# EAGLE design daughterboard_ver4.1 (EAGLE 9.7.0)
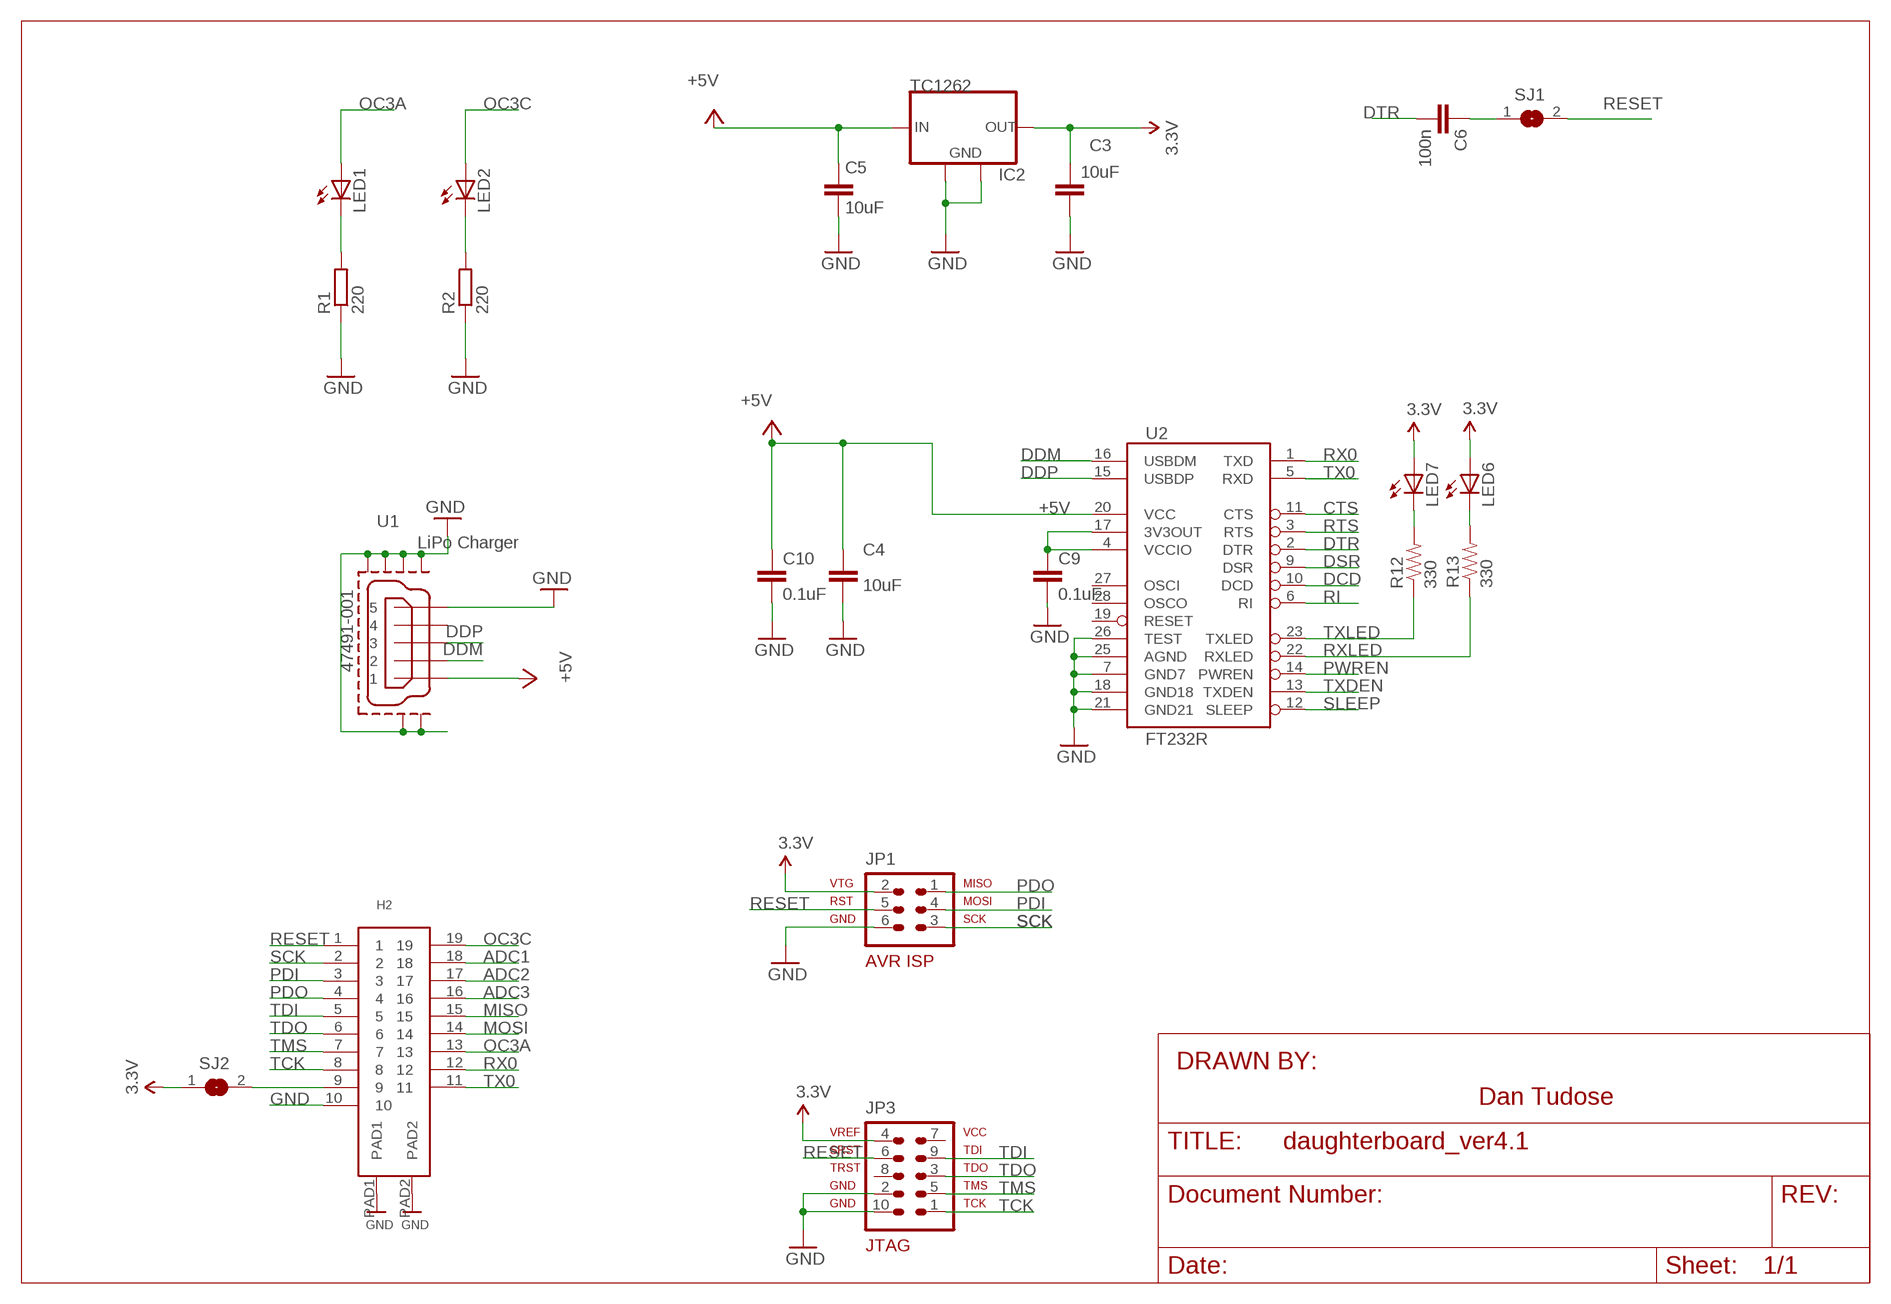
[diagram p0: schematic, sheet 1]

## Parts
C3  10uF  C-EUC0402  [C0402]
C4  10uF  C-EUC0402  [C0402]
C5  10uF  C-EUC0402  [C0402]
C6  100n  C-EUC0402  [C0402]
C9  0.1uF  CAP0402-CAP  [0402-CAP]
C10  0.1uF  CAP0402-CAP  [0402-CAP]
H2  DF9-19P-1V(32)  [DF9-19P-1V(32)]
IC2  TC1262  MCP1825S-SOT223  [SOT223]
JP1  AVR-ISP-6SMD  [2X3SMD]
JP3  AVR-JTAG-10  [AVR-JTAG-10]
LED1  LEDCHIPLED_0603  [CHIPLED_0603]
LED2  LEDCHIPLED_0603  [CHIPLED_0603]
LED6  LEDCHIP-LED0603  [CHIP-LED0603]
LED7  LEDCHIP-LED0603  [CHIP-LED0603]
R1  220  R-EU_R0402  [R0402]
R2  220  R-EU_R0402  [R0402]
R12  330  RESISTOR0402-RES  [0402-RES]
R13  330  RESISTOR0402-RES  [0402-RES]
SJ1  SJ  [SJ]
SJ2  SJ  [SJ]
U1  47491-001  [47491-0001]
U2  FT232R  FT232RLSSOP  [SSOP28DB]

## Nets
3.3V: C3.1 IC2.3(OUT) JP1.2 JP3.4 LED6.A LED7.A SJ2.1
+5V [power]: C4.1 C5.1 C10.1 IC2.1(IN) U1.1 U2.20(VCC)
ADC1: H2.18
ADC2: H2.17
ADC3: H2.16
CTS: U2.11(CTS)
DCD: U2.10(DCD)
DDM: U1.2 U2.16(USBDM)
DDP: U1.3 U2.15(USBDP)
DSR: U2.9(DSR)
DTR: C6.2 U2.2(DTR)
GND: C3.2 C4.2 C5.2 C9.2 C10.2 H2.10 H2.PAD1 H2.PAD2 IC2.2(GND) IC2.4(GND) JP1.6 JP3.2 JP3.10 R1.1 R2.1 U1.5 U1.GND1 U1.GND2 U1.GND3 U1.GND4 U1.GND5 U1.GND6 U2.7(GND7) U2.18(GND18) U2.21(GND21) U2.25(AGND) U2.26(TEST)
MISO: H2.15
MOSI: H2.14
N$1: LED7.C R12.2
N$2: LED6.C R13.2
N$3: H2.9 SJ2.2
N$9: LED1.C R1.2
N$11: LED2.C R2.2
N$13: C9.1 U2.4(VCCIO) U2.17(3V3OUT)
N$34: C6.1 SJ1.1
OC3A: H2.13 LED1.A
OC3C: H2.19 LED2.A
PDI: H2.3 JP1.4
PDO: H2.4 JP1.1
PWREN: U2.14(PWREN)
RESET: H2.1 JP1.5 JP3.6 SJ1.2
RI: U2.6(RI)
RTS: U2.3(RTS)
RX0: H2.12 U2.1(TXD)
RXLED: R13.1 U2.22(RXLED)
SCK: H2.2 JP1.3
SLEEP: U2.12(SLEEP)
TCK: H2.8 JP3.1
TDI: H2.5 JP3.9
TDO: H2.6 JP3.3
TMS: H2.7 JP3.5
TX0: H2.11 U2.5(RXD)
TXDEN: U2.13(TXDEN)
TXLED: R12.1 U2.23(TXLED)
Unconnected: JP3.7 JP3.8 U1.4 U2.19(RESET) U2.27(OSCI) U2.28(OSCO)

## Notes on the sheet
- LiPo Charger
- DRAWN BY:
- Dan Tudose

## Library data of the parts
C3-C6 = rcl:C-EU: CAPACITOR, European symbol
C9 C10 = SparkFun:CAP: Capacitor Standard 0603 ceramic capacitor, and 0.1" leaded capacitor.
H2 = dan:DF9-19P-1V(32)
IC2 = Spark:MCP1825S: 500 mA, Low Voltage, Low Quiescent Current LDO Regulator
JP1 = atmel-1:AVR-ISP-6: AVR ISP-6 Serial Programming Header
JP3 = dan:AVR-JTAG-10: AVR JTAG Debug/Programming Header
LED1 LED2 LED6 LED7 = led:LED: LED OSRAM: - CHIPLED LG R971, LG N971, LY N971, LG Q971, LY Q971, LO R971, LY R971 LH N974, LH R974 LS Q976, LO Q976, LY Q976 LO Q996 - Hyper CHIPLED LW Q18S LB Q993, LB Q99A, LB R99A - SideLED LS A670, LO A670, LY A670, LG A670, LP A670 LB A673, LV A673, LT A673, LW A673 LH A674 LY A675 LS A676, LA A676, LO A676, LY A676, LW A676 LS A679, LY A679, LG A679 - Hyper Micro SIDELED® LS Y876, LA Y876, LO Y876, LY Y876 LT Y87S - SmartLED LW L88C, LW L88S LB L89C, LB L89S, LG L890 LS L89K, LO L89K, LY L89K LS L896, LA L896, LO L896, LY L896 - TOPLED LS T670, LO T670, LY T670, LG T670, LP T670 LSG T670, LSP T670, LSY T670, LOP T670, LYG T670 LG T671, LOG T671, LSG T671 LB T673, LV T673, LT T673, LW T673 LH T674 LS T676, LA T676, LO T676, LY T676, LB T676, LH T676, LSB T676, LW T676 LB T67C, LV T67C, LT T67C, LS T67K, LO T67K, LY T67K, LW E67C LS E67B, LA E67B, LO E67B, LY E67B, LB E67C, LV E67C, LT E67C LW T67C LS T679, LY T679, LG T679 LS T770, LO T770, LY T770, LG T770, LP T770 LB T773, LV T773, LT T773, LW T773 LH T774 LS E675, LA E675, LY E675, LS T675 LS T776, LA T776, LO T776, LY T776, LB T776 LHGB T686 LT T68C, LB T68C - Hyper Mini TOPLED® LB M676 - Mini TOPLED Santana® LG M470 LS M47K, LO M47K, LY M47K Source: http://www.osram.convergy.de LUXEON: - LUMILED® LXK2-PW12-R00, LXK2-PW12-S00, LXK2-PW14-U00, LXK2-PW14-V00 LXK2-PM12-R00, LXK2-PM12-S00, LXK2-PM14-U00 LXK2-PE12-Q00, LXK2-PE12-R00, LXK2-PE12-S00, LXK2-PE14-T00, LXK2-PE14-U00 LXK2-PB12-K00, LXK2-PB12-L00, LXK2-PB12-M00, LXK2-PB14-N00, LXK2-PB14-P00, LXK2-PB14-Q00 LXK2-PR12-L00, LXK2-PR12-M00, LXK2-PR14-Q00, LXK2-PR14-R00 LXK2-PD12-Q00, LXK2-PD12-R00, LXK2-PD12-S00 LXK2-PH12-R00, LXK2-PH12-S00 LXK2-PL12-P00, LXK2-PL12-Q00, LXK2-PL12-R00 Source: www.luxeon.com KINGBRIGHT: KA-3528ASYC Source: www.kingbright.com
R1 R2 = resistor:R-EU_: RESISTOR, European symbol
R12 R13 = SparkFun:RESISTOR: Resistor Basic schematic elements and footprints for 0603, 1206, and PTH 1/10th watt (small) resistors.
SJ1 SJ2 = jumper:SJ: SMD solder JUMPER
U1 = usb_con-update:47491-001
U2 = SparkFun:FT232RL: USB UART FT232RL 4th Generation USB UART (USB <-> Serial) Controller. Spark Fun Electronics SKU : COM-00650

## Net classes
1 power: width 0.61 mm

## Board
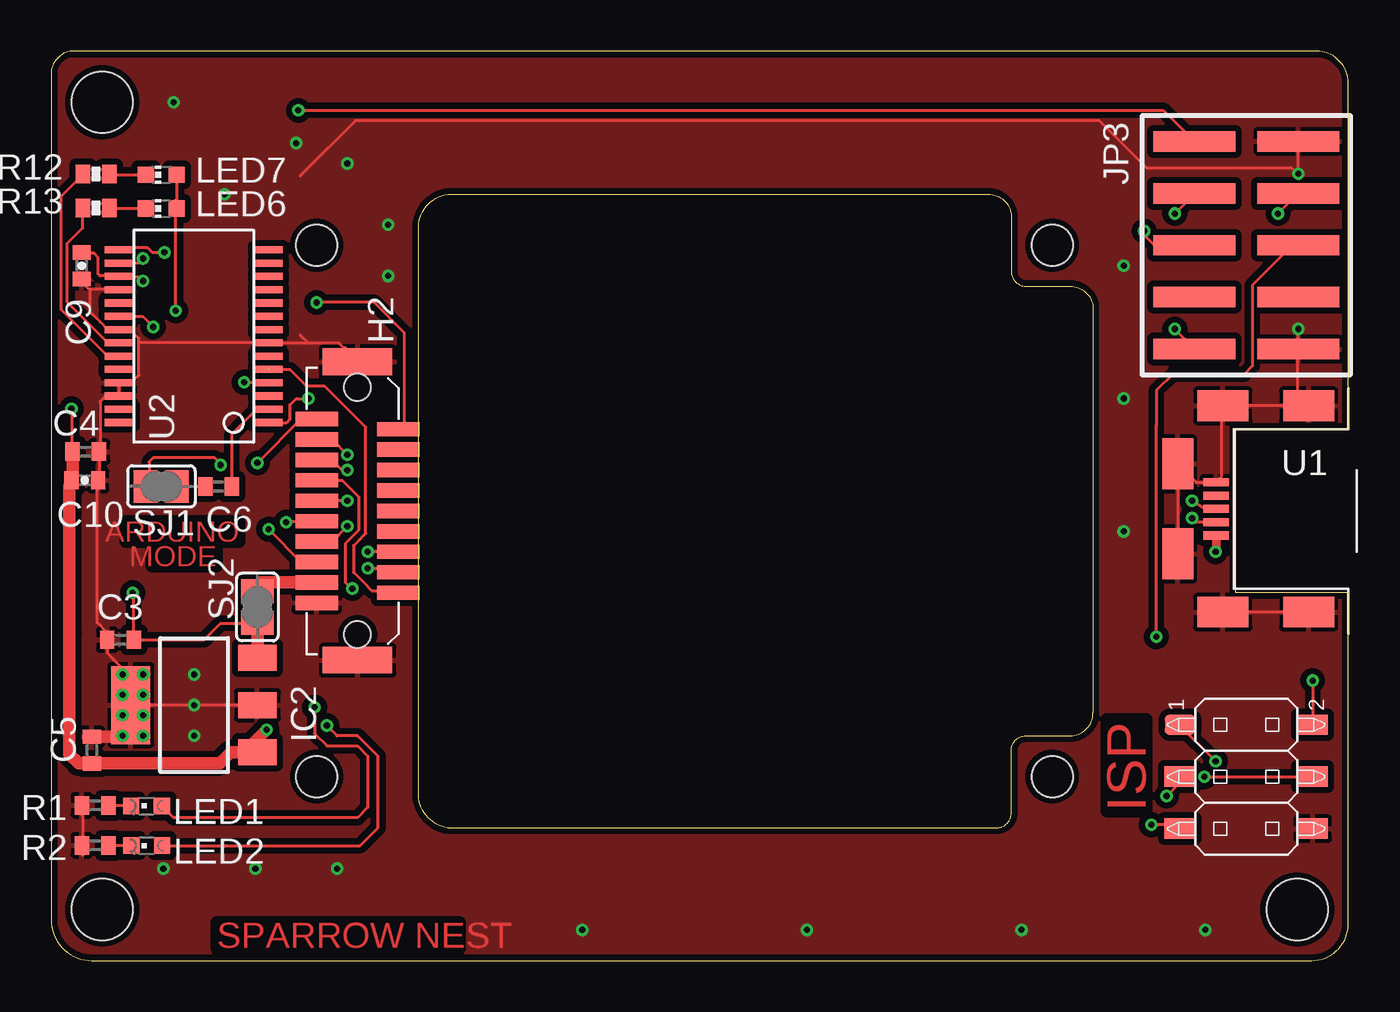
[diagram p1: board, top side]
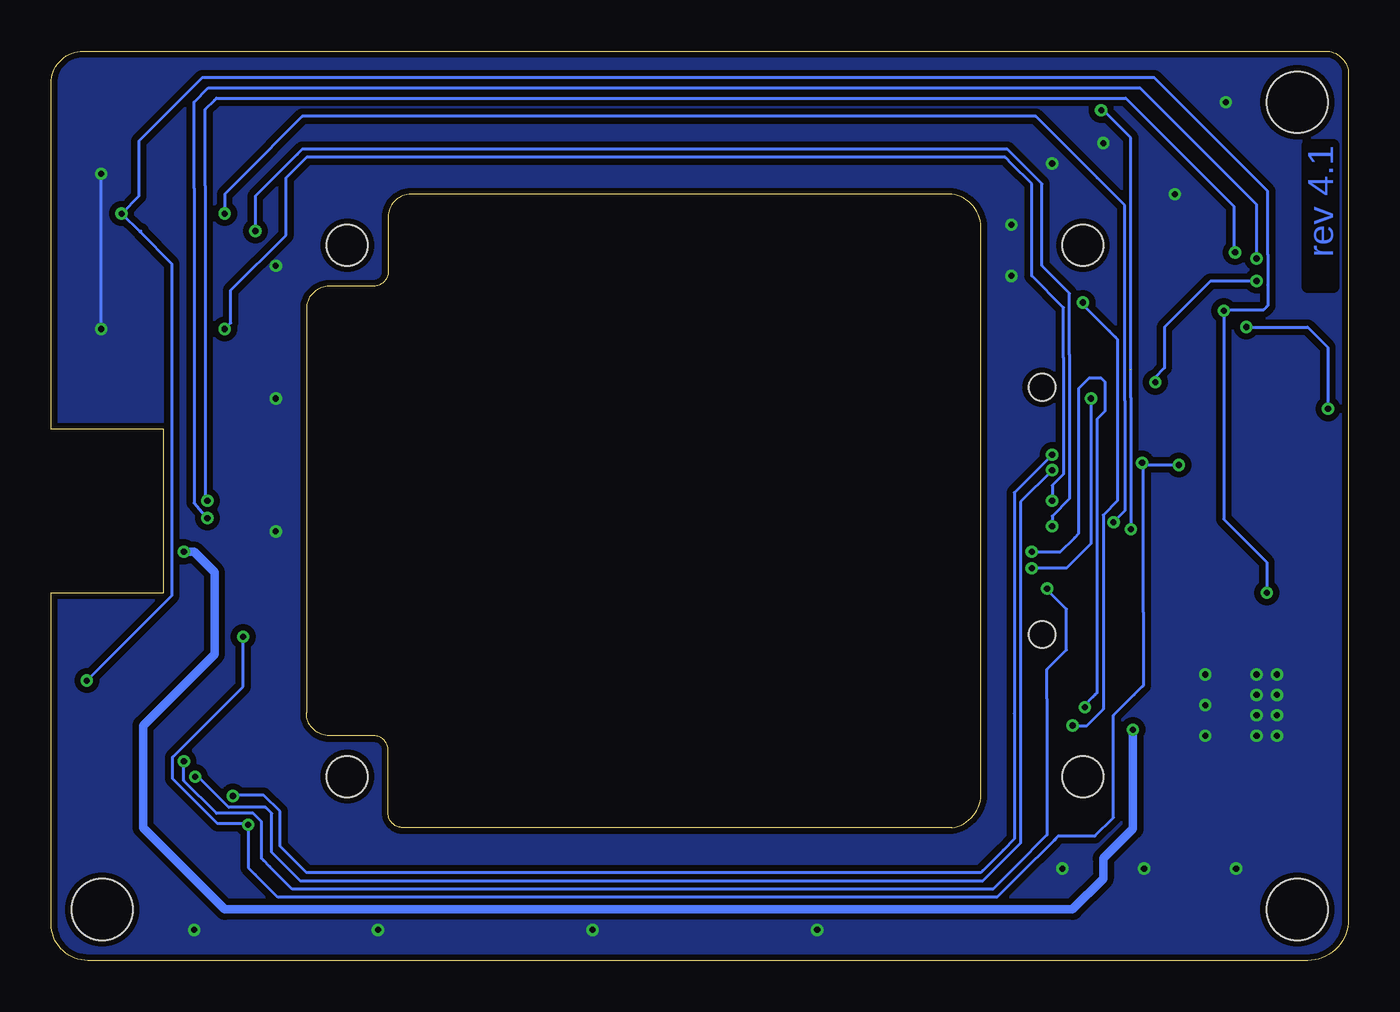
[diagram p2: board, bottom side, seen from below]

Size 63.5 x 44.5 mm. Coordinates in mm from the lower left corner, seen from the top.
Outline: 63.5,26 63.5,42.92 arc90 61.92,44.5 1.12,44.5 arc90 0,43.38 0,2 arc90 2,0 61.7,0 arc90 63.5,1.8 63.5,18 58,18 58,26 63.5,26
Outline: 19.41,6.5 46.29,6.5 arc90 47,7.21 47,10.29 arc-90 47.71,11 49.88,11 arc90 51,12.12 51,31.88 arc90 49.88,33 47.71,33 arc-90 47,33.71 47,36.38 arc90 45.88,37.5 19.41,37.5 arc90 18,35.59 18,8.41 arc90 19.41,6.5
Copper layers (1*16): Top 0.035mm / dielectric 1.5mm / Bottom 0.035mm
Design rules "Fusion Electronics Design Rules": minimum track width 0.15mm, minimum drill 0.3mm, track to track 0.15mm, track to pad 0.15mm, pad to pad 0.15mm, via to via 0.15mm, smd to smd 0.15mm, copper to edge 0.3mm, drill to drill 0.2mm, minimum pad ring 0.2mm, minimum via ring 0.15mm, stop-mask expansion 0.075mm, vias tented up to drill 12mil, thermal gap 0.2mm
Holes 3 mm at 2.5,42 2.5,2.5 61,2.5
Holes 2 mm at 49,9 49,35 13,9 13,35

### Footprints (pad centres in the part's own frame; a part is rotated, then mirrored left to right if it is on the bottom)
C0402 = smd 0.7 x 0.9: 1 -0.65,0; 2 0.65,0
0402-CAP = smd 0.7 x 0.9: 1 -0.65,0; 2 0.65,0
DF9-19P-1V(32) = smd 0.7 x 2.08: 1 -4.5,-2; 2 -3.5,-2; 3 -2.5,-2; 4 -1.5,-2; 5 -0.5,-2; 6 0.5,-2; 7 1.5,-2; 8 2.5,-2; 9 3.5,-2; 10 4.5,-2; 11 4,2; 12 3,2; 13 2,2; 14 1,2; 15 0,2; 16 -1,2; 17 -2,2; 18 -3,2; 19 -4,2 | smd 1.3 x 3.4: PAD1 7.3,0; PAD2 -7.3,0 | hole 1.3: 6.05,0; -6.05,0
SOT223 = smd 1.27 x 1.905: 1 -2.311,-3.099; 2 0,-3.099; 3 2.311,-3.099 | smd 3.81 x 1.905: 4 0,3.099
2X3SMD = smd 1 x 1.5: 1 -2.54,-3.25; 2 -2.54,3.25; 3 0,-3.25; 4 0,3.25; 5 2.54,-3.25; 6 2.54,3.25
AVR-JTAG-10 = smd 1 x 4: 1 -5.08,-2.54; 2 -5.08,2.54; 3 -2.54,-2.54; 4 -2.54,2.54; 5 0,-2.54; 6 0,2.54; 7 2.54,-2.54; 8 2.54,2.54; 9 5.08,-2.54; 10 5.08,2.54
CHIPLED_0603 = smd 0.8 x 0.8: A 0,-0.75; C 0,0.75
CHIP-LED0603 = smd 0.8 x 0.8: A 0,-0.75; C 0,0.75
R0402 = smd 0.7 x 0.9: 1 -0.65,0; 2 0.65,0
0402-RES = smd 0.7 x 0.9: 1 -0.65,0; 2 0.65,0
SJ = smd 1.168 x 1.6: 1 -0.762,0; 2 0.762,0
47491-0001 = smd 1.25 x 0.4: 1 6.475,5.2; 2 6.475,4.55; 3 6.475,3.9; 4 6.475,3.25; 5 6.475,2.6 | smd 2.5 x 1.5: GND1 1.95,8.95; GND2 6.15,8.95; GND5 6.15,-1.15; GND6 1.95,-1.15 | smd 1.5 x 2.5: GND3 8.35,6.1; GND4 8.35,1.7
SSOP28DB = smd 0.348 x 1.397: 1 -4.225,-3.656; 2 -3.575,-3.656; 3 -2.925,-3.656; 4 -2.275,-3.656; 5 -1.625,-3.656; 6 -0.975,-3.656; 7 -0.325,-3.656; 8 0.325,-3.656; 9 0.975,-3.656; 10 1.625,-3.656; 11 2.275,-3.656; 12 2.925,-3.656; 13 3.575,-3.656; 14 4.225,-3.656; 15 4.225,3.656; 16 3.575,3.656; 17 2.925,3.656; 18 2.275,3.656; 19 1.625,3.656; 20 0.975,3.656; 21 0.325,3.656; 22 -0.325,3.656; 23 -0.975,3.656; 24 -1.625,3.656; 25 -2.275,3.656; 26 -2.925,3.656; 27 -3.575,3.656; 28 -4.225,3.656

### Placement (x,y rotation side)
C3  3.4,15.7 180 top
C4  1.7,24.9 0 top
C5  2,10.3 90 top
C6  8.2,23.2 0 top
C9  1.5,34 270 top
C10  1.66,23.5 0 top
H2  15,22 270 top
IC2  7,12.5 90 top
JP1  58.5,9 270 top
JP3  58.5,35 270 top
LED1  4.67,7.57 90 top
LED2  4.69,5.63 90 top
LED6  5.4,36.8 90 top
LED7  5.4,38.45 90 top
R1  2.15,7.59 0 top
R2  2.15,5.64 0 top
R12  2.2,38.49 0 top
R13  2.2,36.83 0 top
SJ1  5.4,23.2 180 top
SJ2  10.1,17.3 90 top
U1  63.5,26 180 top
U2  6.99,30.55 90 top

### Tracks (layer width: path | path; a pad name or v marks a point on that pad's centre or on a via)
3.3V  (via drill 0.3)
  Top 0.15: LED7.A LED6.A 6.1,37.25 v6.1,31.8 | v61.75,13.7 JP1.2 | v60.05,36.55 61,37.5 JP3.4 | C3.1 4,15.7 | C3.1 7.5,15.7 8.3,16.5 10.1,16.5 | 10.1,16.5 10.2,16.6 | SJ2.1 10.1,16.5 | C3.1 4.05,17.95 v4,18
  Top 0.61: SJ2.1 10.1,16.5 IC2.3
  Bottom 0.15: v61.75,13.7 57.6,17.85 57.6,34.1 59.15,35.65 | 59.15,35.65 v60.05,36.55 59.2,37.4 59.2,40.1 56.1,43.2 9.5,43.2 3.95,37.65 3.95,34.55 3.95,33.05 3.95,32.05 4,32 4.15,31.85 6.05,31.85 v6.1,31.8 6.1,21.6 4,19.5 4,18.1 | 59.1,35.7 59.15,35.65 | 4,18.1 3.9,18 | v4,18 4,18.1
+5V  (via drill 0.3)
  Top 0.15: U2.20 4.47,31.52 v5,31 | v1,27 1,24.95 C4.1
  Top 0.406: U1.1 57.02,20.02 v57,20
  Top 0.61: C4.1 1.05,23.5 C10.1 0.9,23.2 0.9,15.95 0.9,10.1 1.35,9.65 C5.1 8.25,9.65 8.8,10.2 9.5,10.2 9.7,10.4 9.89,10.4 IC2.1 9.65,10.4 v10.55,11.3
  Bottom 0.15: v5,31 2,31 1,30 v1,27
  Bottom 0.406: v57,20 56.5,20 55.5,19 55.5,15 59,11.5 59,6.5 55,2.5 13.5,2.5 12,4 12,5 10.55,6.45 v10.55,11.3
DDM  (via drill 0.3)
  Top 0.15: U1.2 57,21.45 56.35,21.45 56.05,21.45 55.9,21.6 | U2.16 3.35,34.15 4.3,34.15 v4.5,34.35 | 55.9,21.6 v55.85,21.65 | v55.85,21.65 55.8,21.7 | v55.85,21.65 55.9,21.6
  Bottom 0.15: v55.85,21.65 56.5,22.4 56.5,37.8 56.5,42 55.8,42.7 10.2,42.7 4.5,37 4.5,34.4 v4.5,34.35
DDP  (via drill 0.3)
  Top 0.15: v55.85,22.5 56.45,22.1 57,22.1 U1.3 | v5.55,34.65 4.95,34.65 4.7,34.9 3.45,34.9 3.35,34.8 U2.15
  Bottom 0.15: v55.85,22.5 55.9,22.5 55.95,22.55 55.95,37.9 55.95,41.65 55.5,42.1 55.4,42.2 10.9,42.2 5.6,36.9 5.6,34.6 v5.55,34.65 | v55.85,22.5 55.8,22.5 v55.85,22.5
DTR
  Top 0.15: C6.2 8.85,25.75 10.05,26.95 10.6,26.95 U2.2
GND  (via drill 0.3)
  Top 0.15: 12.6,30.2 14.1,30.2 14.35,29.95 | 12.6,30.2 10.65,30.2 U2.7 10.6,30.25 4.35,30.25 4.3,30.25 | H2.PAD2 14.35,29.95 | 2.75,32.85 3.3,32.85 U2.18 | 4.3,30.25 4.3,28.65 3.92,28.27 U2.25 3.3,28.25 3.3,27.66 | 4.3,30.25 4.3,30.45 3.9,30.85 3.4,30.85 U2.21 3.3,30.9 2.75,30.9 2.4,31.25 1.9,31.75 1.9,32.8 1.95,32.85 2.75,32.85 | 3.35,27.7 U2.26 3.3,27.66 | R2.1 1.55,5.15 1.55,7.05 R1.1 | IC2.2 | IC2.2 | IC2.2 | IC2.2 10.05,12.5 3.95,12.5 IC2.4 3.8,12.5 3.7,12.6 3.7,13 3.7,14.1 3.1,14.7 2.75,15.05 C3.2 2.75,16.05 2.25,16.55 2.25,23.45 C10.2 2.35,23.5 C4.2 2.4,24.95 2.4,27.35 2.71,27.66 3.3,27.66 | v61.05,38.5 61.05,40.05 JP3.2 | v61.05,30.9 61.05,29.95 JP3.10 61,29.9 61,27.2 U1.GND6 U1.GND5 57.3,27.1 57.3,23.7 57.05,23.45 U1.5 57,23.4 56.05,23.4 U1.GND4 55.15,24.2 U1.GND3 55.2,19.85 | U1.GND1 61.5,17.05 U1.GND2 57.95,17.1 | 14.4,30 14.35,29.95 | 61,38.45 v61.05,38.5 | 2.75,32.85 1.85,32.85 1.5,33.2 1.5,33.3 | 1.5,33.3 C9.2 | C9.2 1.5,33.4 | C9.2 1.5,33.3 | v61.05,38.5 61,38.5 60.7,38.8 53.6,38.8 53.3,39.1 51.3,41.1 14.9,41.1 12.3,38.5 12.2,38.4 | 14.9,29.4 H2.PAD2 | H2.PAD2 15,29.2 H2.PAD2 | 12.2,30.6 12.6,30.2
  Top 0.61: C5.2 3.65,10.95 3.9,11.2 3.9,12.8 3.7,13
  Bottom 0.15: v61.05,30.9 v61.05,38.5
  other vias: 7,14 7,11 7,12.5 4.5,14 3.5,14 3.5,13 4.5,13 4.5,12 3.5,12 3.5,11 4.5,11 52.5,21 52.5,27.5 52.5,34 16.5,36 16.5,33.5 5.5,4.5 10,4.5 14,4.5 26,1.5 37,1.5 47.5,1.5 56.5,1.5 14.5,39 12,40 8.5,37.5 6,42
  pour Top (isolate 0.305): -1,45 -1,-3 65,-2 65,45
  pour Bottom (isolate 0.305): -2,46 -2,-1.5 66,-1 66,46
N$1
  Top 0.15: LED7.C 2.9,38.45 R12.2
N$2
  Top 0.15: LED6.C 2.9,36.8 R13.2
N$3
  Top 0.61: H2.9 10.3,18.5 9.9,18.1 10,18 10.06,18.06 SJ2.2
N$9
  Top 0.15: R1.2 3.91,7.59 4,7.5 3.99,7.5 LED1.C
N$11
  Top 0.15: LED2.C 2.82,5.63 R2.2
N$13  (via drill 0.3)
  Top 0.15: C9.1 1.6,34.65 1.55,34.65 1.5,34.6 1.6,34.6 2.1,34.6 2.3,34.4 2.3,33.6 2.4,33.5 2.75,33.5 3.3,33.5 U2.17 3.4,33.45 4.25,33.45 4.4,33.3 4.45,33.25 v4.5,33.25 | v9.45,28.3 10.6,28.3 U2.4
  Bottom 0.15: v4.5,33.25 6.75,33.25 9,31 9,29 9.45,28.55 v9.45,28.3
N$34
  Top 0.15: SJ1.1 C6.1 | C6.1 7.6,23.2 C6.1
OC3A  (via drill 0.3)
  Top 0.15: H2.13 17.75,20 v15.5,20 | v12.9,12.4 12.9,11.1 13.5,10.5 15,10.5 15.5,10 15.5,7.5 15,7 6,7 5.5,7.5 LED1.A
  Bottom 0.15: v15.5,20 14.1,20 13.4,20.7 13.2,20.9 13.2,28 12.7,28.5 12.1,28.5 11.9,28.3 11.9,26.9 12.3,26.5 12.3,13.1 12.4,13 12.5,12.9 12.9,12.5 v12.9,12.4
OC3C  (via drill 0.3)
  Top 0.15: H2.19 17.75,26 17.3,26 17.3,30.7 15.8,32.2 v13,32.2 | v13.5,11.5 13.9,11.1 14,11 15,11 16,10 16,6.5 15.13,5.63 9.13,5.63 LED2.A
  Bottom 0.15: v13,32.2 13,32.1 11.7,30.8 11.4,30.5 11.3,30.4 11.3,22.5 12,21.8 12,12.3 12.8,11.5 v13.5,11.5
PDI  (via drill 0.3)
  Top 0.15: v56.45,9 JP1.4 | v14.5,24 14.25,24 13.75,24.5 H2.3
  Bottom 0.15: v56.45,9 56.3,9 54.8,7.5 53,7.5 52.7,7.2 52.7,5.3 52.4,5 51.3,3.9 17.9,3.9 16.8,5 16.05,5.75 16.05,11.95 16.05,22.45 v14.5,24
PDO  (via drill 0.3)
  Top 0.15: v57,9.75 55.25,11.5 JP1.1 | H2.4 14.25,23.5 15.05,22.7 15.05,21.05 14.75,20.75 14.4,20.4 14.4,18.5 14.7,18.2 | 14.7,18.2 v14.75,18.2 | v14.75,18.2 14.8,18.2 | v14.75,18.2 14.7,18.2
  Bottom 0.15: v57,9.75 57,8.8 55.4,7.2 53.6,7.2 53.2,6.8 53.2,5 53.1,4.9 52.8,4.6 51.7,3.5 17.4,3.5 16.3,4.6 14.75,6.15 14.75,12.8 14.75,14.25 13.8,15.2 13.8,17.2 14.8,18.2 v14.75,18.2
RESET  (via drill 0.3)
  Top 0.15: 4.75,23.5 4.35,23.3 SJ1.2 4.8,23.36 4.8,23.5 | v10.1,24.35 12.25,26.5 H2.1 | JP1.5 55.25,6.5 55.25,6.65 53.95,6.65 53.8,6.7 v53.85,6.65 | JP3.6 61,35 60.75,35 58.8,33.05 58.8,29.9 58.8,29.1 58.4,28.7 54.9,28.7 54.1,27.9 54.1,26.2 | v54.1,15.85 54.1,26.15 54.1,26.2 | 54.1,26.2 54.1,26.25 | v8.3,24.25 8.3,24.3 8,24.6 5,24.6 4.8,24.4 4.8,23.5 | 4.8,23.5 4.7,23.4
  Bottom 0.15: v8.3,24.25 10,24.25 v10.1,24.35 10.05,24.2 10.05,17.05 10.05,13.45 10.1,13.4 10.5,13 11.5,12 11.5,7 12.4,6.1 14.2,6.1 14.3,6 14.4,5.9 16.1,4.2 17.2,3.1 52.4,3.1 53.5,4.2 53.85,4.55 v53.85,6.65 53.8,6.7 55.35,6.7 57.55,8.9 57.55,9.95 54.1,13.4 v54.1,15.85
RX0  (via drill 0.3)
  Top 0.15: U2.1 11.53,26.32 11.7,26.5 11.7,27.2 12,27.5 v12.6,27.5 | v15.5,19.2 16.8,19.2 H2.12
  Bottom 0.15: v12.6,27.5 12.6,20.4 13.8,19.2 v15.5,19.2
RXLED
  Top 0.15: R13.1 1.55,36.8 1.55,35.85 0.8,35.1 0.8,32.2 2.75,30.25 3.3,30.25 U2.22
SCK  (via drill 0.3)
  Top 0.15: JP1.3 55.25,8.7 v54.6,8.05 | v14.5,24.75 13.75,25.5 H2.2
  Bottom 0.15: v14.5,24.75 16.35,22.9 16.35,12.1 16.35,5.95 16.9,5.4 17.9,4.4 18,4.3 51,4.3 52.1,5.4 52.3,5.6 52.3,7.3 53.1,8.1 54.55,8.1 v54.6,8.05
TCK  (via drill 0.3)
  Top 0.15: H2.8 12.25,19.5 v10.65,21.1 | 55.95,40.05 JP3.1 54.44,41.6 v12.1,41.6
  Bottom 0.15: v10.65,21.1 10.65,27.55 10.65,37.55 10.65,40.25 12,41.6 v12.1,41.6
TDI  (via drill 0.3)
  Top 0.15: v14.5,22.5 H2.5 | v55,30.9 55.95,29.95 JP3.9
  Bottom 0.15: v14.5,22.5 14.5,23.25 13.95,23.8 13.95,29.5 13.95,31.95 15.5,33.5 15.5,38 16.5,39 16.8,39.3 51,39.3 52,38.3 52,35.5 54.7,32.8 54.7,31.2 v55,30.9
TDO  (via drill 0.3)
  Top 0.15: H2.6 11.55,21.5 v11.5,21.45 | v55,36.55 55.95,37.5 JP3.3
  Bottom 0.15: v11.5,21.45 10.95,22 10.95,27.4 10.95,36.95 12.3,38.3 15.3,41.3 51.2,41.3 54.2,38.3 55,37.5 v55,36.55 | v55,36.55 55,36.5 v55,36.55
TMS  (via drill 0.3)
  Top 0.15: H2.7 13.75,20.5 v14.5,21.25 | JP3.5 54,35 53.5,35.5 v53.5,35.7
  Bottom 0.15: v14.5,21.25 14.5,21.75 13.65,22.6 13.65,29.65 13.65,32.65 15,34 15,38 16.7,39.7 51.2,39.7 51.45,39.45 53,37.9 53.5,37.4 v53.5,35.7
TX0  (1 unrouted)
  Top 0.15: 10.7,28.9 11.7,28.9 12.5,28.1 13.4,28.1 15.4,26.1 15.4,20.9 15.3,20.8 15.1,20.6 14.8,20.3 14.8,19 15.3,18.5 15.7,18.1 16.3,18.1 16.4,18 H2.11
TXLED
  Top 0.15: R12.1 1.55,38.45 0.5,37.4 0.5,31.85 2.75,29.6 3.3,29.6 U2.23

### Text on the board
Top: ARDUINO | MODE | ISP | SPARROW NEST
Bottom: rev 4.1
tStop: ARDUINO | MODE | ISP | SPARROW NEST